# Altium schematic sheet Sheet3.SchDoc
size OrCAD A
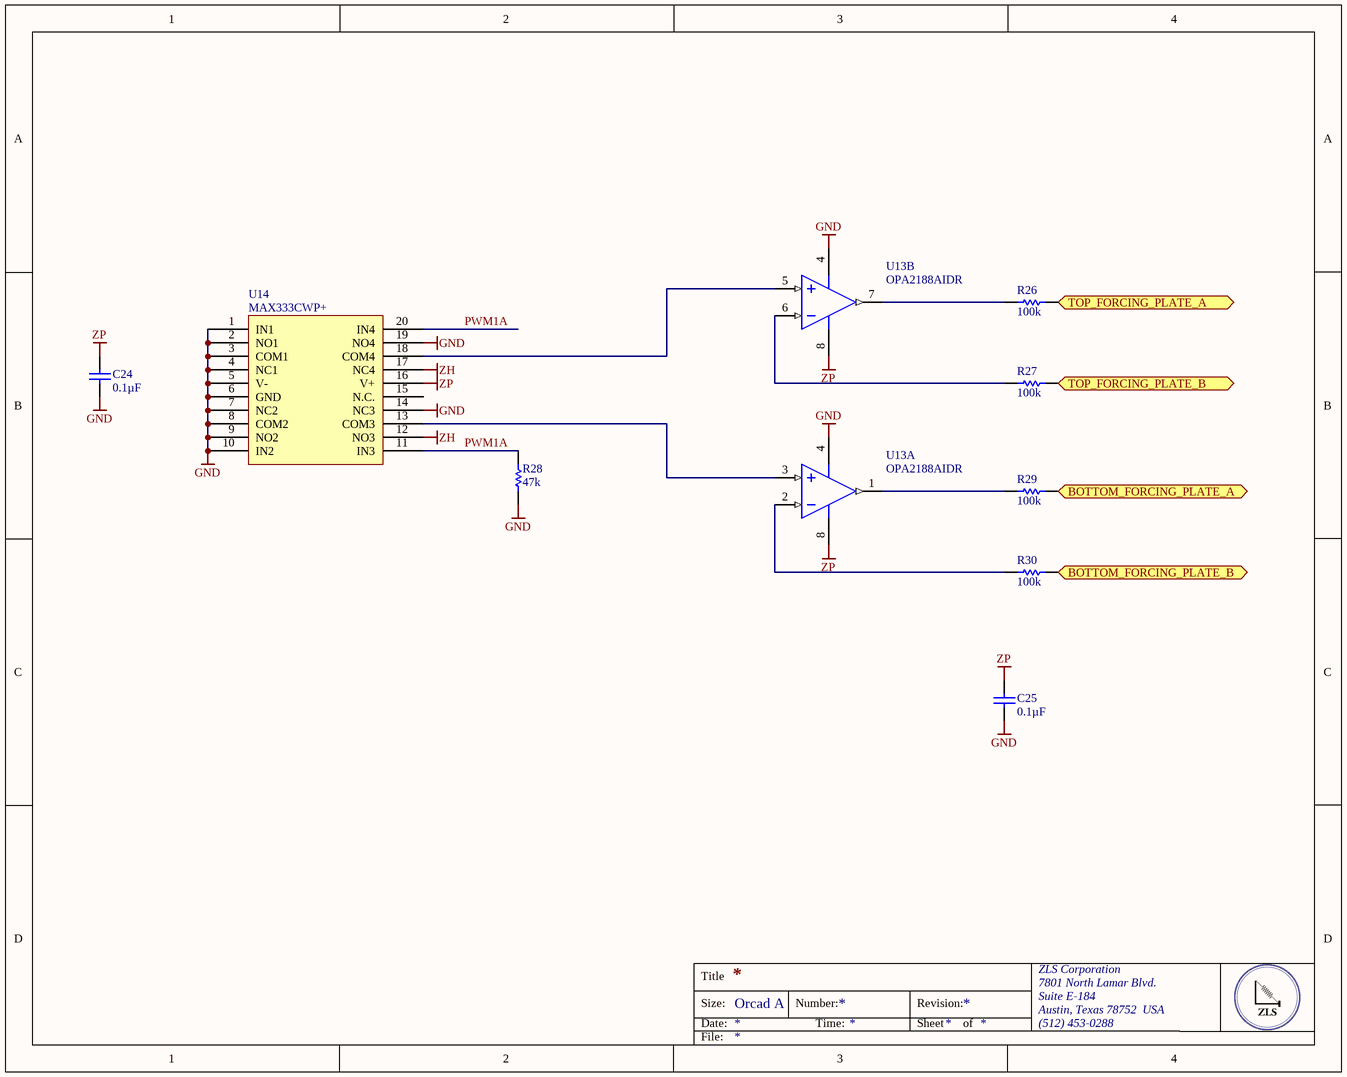
[diagram p0: Sheet3.SchDoc]

## Parts
C24  Capacitance: 0.1µF  [CAPC0805(2012)145_N]  (hidden comment: CAP CER 0.1UF 25V X7R 0805)
C25  Capacitance: 0.1µF  [CAPC0805(2012)145_N]  (hidden comment: CAP CER 0.1UF 25V X7R 0805)
R26  100k  [RESC0402(1005)_M]
R27  100k  [RESC0402(1005)_M]
R28  47k  [RESC0402(1005)_M]
R29  100k  [RESC0402(1005)_M]
R30  100k  [RESC0402(1005)_M]
U13  OPA2188AIDR  [D0008A_L]  (parts A,B of 2)
U14  MAX333CWP+  [TSOP65P640X90-20N]

## Ports
BOTTOM_FORCING_PLATE_A, BOTTOM_FORCING_PLATE_B, TOP_FORCING_PLATE_A, TOP_FORCING_PLATE_B

## Nets
GND: C24.1 C25.1 R28.1 U13.4(V-) U14.1(IN1) U14.2(NO1) U14.3(COM1) U14.4(NC1) U14.5(V-) U14.6(GND) U14.7(NC2) U14.8(COM2) U14.9(NO2) U14.10(IN2) U14.14(NC3) U14.19(NO4)
ZH: U14.12(NO3) U14.17(NC4)
ZP: C24.2 C25.2 U13.8(V+) U14.16(V+)
BOTTOM_FORCING_PLATE_A: R29.1 ; port BOTTOM_FORCING_PLATE_A
BOTTOM_FORCING_PLATE_B: R30.1 ; port BOTTOM_FORCING_PLATE_B
PWM1A: R28.2 U14.11(IN3) U14.20(IN4)
TOP_FORCING_PLATE_A: R26.1 ; port TOP_FORCING_PLATE_A
TOP_FORCING_PLATE_B: R27.1 ; port TOP_FORCING_PLATE_B
NetR26_2: R26.2 U13.7(OUT_B)
NetR27_2: R27.2 U13.6(IN_B-)
NetR29_2: R29.2 U13.1(OUT_A)
NetR30_2: R30.2 U13.2(IN_A-)
NetU13_3: U13.3(IN_A+) U14.13(COM3)
NetU13_5: U13.5(IN_B+) U14.18(COM4)

Not connected (* = marked no-connect by the designer): U14 15(N.C.)

## Notes on the sheet
- Title
- Size:
- Date:
- Orcad A
- Number:
- Time:
- Revision:
- Sheet
- of
- ZLS Corporation
- 7801 North Lamar Blvd.
- Suite E-184
- Austin, Texas 78752  USA
- (512) 453-0288
- File:

## Library data of the parts
C24 C25 = CMP-1036-04795-1: Manufacturer: Murata Electronics North America; Manufacturer Part Number: GRM21BR71E104KA01L; Tolerance: ±10%; Supplier 1: Digi-Key; Supplier Part Number 1: 490-1673-6-ND; RoHS: RoHS Compliant; Category: Capacitors; Stock 1: 891652; Pricing 1: 1=0.2, 10=0.145, 100=0.0683, 500=0.04788, 1000=0.03964 (USD); Packaging: Digi-Reel®; Part Status: Active; Voltage - Rated: 25V; Temperature Coefficient: X7R; Operating Temperature: -55°C ~ 125°C; Features: -; Ratings: -; Applications: General Purpose; Mounting Type: Surface Mount, MLCC; Package / Case: 0805 (2012 Metric); Size / Dimension: 0.079" L x 0.049" W (2.00mm x 1.25mm); Height - Seated (Max): -; Thickness (Max): 0.053" (1.35mm); Lead Spacing: -; Lead Style: -; ComponentLink1URL: http://www.murata.com/~/media/webrenewal/support/library/catalog/products/capacitor/mlcc/c02e.ashx; ComponentLink1Description: http://www.murata.com/~/media/webrenewal/support/library/catalog/products/capacitor/mlcc/c02e.ashx
R26-R30 = CMP-1011-00651-1: RES SMD 10K OHM 1% 1/8W 0402; Manufacturer: Vishay Dale; Manufacturer Part Number: CRCW0402100KFKEDHP; Supplier Part Number 1: CRCW0402100KFKEDHP/BKN; Case/Package: 0402; Case Code (Metric): 1005; Case Code (Imperial): 0402; Contact Plating: Tin; Composition: Thick Film; Length: 1mm; Height: 0.3mm; Depth: 0.5mm; Lead Free: Lead Free; ComponentLink1URL: https://datasheet.ciiva.com/8982/crcwhpe3-8982553.pdf; ComponentLink1Description: https://datasheet.ciiva.com/8982/crcwhpe3-8982553.pdf; ComponentLink2URL: https://datasheet.ciiva.com/2498/crcwhpe3-2498716.pdf; ComponentLink2Description: https://datasheet.ciiva.com/2498/crcwhpe3-2498716.pdf; ComponentLink3URL: https://datasheet.ciiva.com/2498/crcwhpe3-2498717.pdf; ComponentLink3Description: https://datasheet.ciiva.com/2498/crcwhpe3-2498717.pdf; ComponentLink4URL: https://datasheet.ciiva.com/5548/crcwhpe3-46056-5548557.pdf; ComponentLink4Description: https://datasheet.ciiva.com/5548/crcwhpe3-46056-5548557.pdf; ComponentLink5URL: https://datasheet.ciiva.com/2498/crcwhpe3-2498718.pdf; ComponentLink5Description: https://datasheet.ciiva.com/2498/crcwhpe3-2498718.pdf; ComponentLink6URL: https://datasheet.ciiva.com/48525/crcwhpe3-48525582.pdf; ComponentLink6Description: https://datasheet.ciiva.com/48525/crcwhpe3-48525582.pdf; ComponentLink7URL: https://datasheet.ciiva.com/46441/1703058-46441599.pdf; ComponentLink7Description: https://datasheet.ciiva.com/46441/1703058-46441599.pdf
U13 = CMP-0272-00241-3: 0.03 uV/degC, 6 uV Vos, Low Noise, Rail-to-Rail Output, Zero-Drift Operational Amplifier, 4 to 36 V, -40 to 105 degC, 8-pin SOIC (D8), Green (RoHS & no Sb/Br); Manufacturer: Texas Instruments; Number of Circuits: 2; Slew Rate: 0.8 V/µs; Current - Supply: 415µA; Current - Output / Channel: 18mA; Voltage - Supply, Single/Dual (±): 4 V ~ 36 V, ±2 V ~ 18 V; Supplier 1: Digi-Key; Supplier Part Number 1: 296-29454-6-ND; Manufacturer Part Number: OPA2188AIDR; RoHS: RoHS Compliant; Category: Integrated Circuits (ICs); Stock 1: 8272; Pricing 1: 1=3.44, 10=3.089, 100=2.5307, 500=2.15434, 1000=1.81692 (USD); Packaging: Digi-Reel®; Part Status: Active; Amplifier Type: Zero-Drift; Output Type: Rail-to-Rail; -3db Bandwidth: -; Operating Temperature: -40°C ~ 105°C; Mounting Type: Surface Mount; Package / Case: 8-SOIC (0.154", 3.90mm Width); Supplier Device Package: 8-SOIC; ComponentLink1URL: http://www.ti.com/lit/ds/symlink/opa2188.pdf; ComponentLink1Description: http://www.ti.com/lit/ds/symlink/opa2188.pdf
U14 = MAX333CWP+: IC SWITCH QUAD SPDT 20TSSOP; Manufacturer: Maxim; Manufacturer Part Number: MAX333AEUP+; Max Supply Voltage: 30V; Min Supply Voltage: 10V; Min Dual Supply Voltage: 4.5V; Max Dual Supply Voltage: 20V; On-State Resistance: 35R; Operating Supply Current: 1uA; Supply Type: Single,Dual; Max Power Dissipation: 559mW; Turn-On Delay Time: 175ns; Turn-Off Delay Time: 145ns; Max Supply Current: 250uA; Number of Bits: 4; Dual Supply Voltage: 15V; Supplier 1: Mouser; Supplier Part Number 1: 700-MAX333AEUP; Stock 1: 664; Pricing 1: 1=6.77, 10=6.43, 50=5.8, 100=5.8, 1000=5.62, 10000=5.62 (USD); Case/Package: TSSOP; Number of Pins: 20; Weight: 0.006737oz; Min Operating Temperature: -40°C; Max Operating Temperature: 85°C; Packaging: Rail/Tube; Package Quantity: 74; Throw Configuration: SPDT; Number of Channels: 4; Length: 6.6mm; Height: 0.95mm; Width: 4.5mm; Radiation Hardening: No; Lead Free: Lead Free; REACH SVHC: Unknown; ComponentLink1URL: https://datasheet.ciiva.com/2978/max333a-2978850.pdf; ComponentLink1Description: https://datasheet.ciiva.com/2978/max333a-2978850.pdf; ComponentLink2URL: https://datasheet.ciiva.com/30478/0900766b81253c85-30478260.pdf; ComponentLink2Description: https://datasheet.ciiva.com/30478/0900766b81253c85-30478260.pdf; ComponentLink3URL: https://datasheet.ciiva.com/1674/max333a-1674617.pdf; ComponentLink3Description: https://datasheet.ciiva.com/1674/max333a-1674617.pdf; ComponentLink4URL: https://datasheet.ciiva.com/26825/max333aeup-26825546.pdf; ComponentLink4Description: https://datasheet.ciiva.com/26825/max333aeup-26825546.pdf